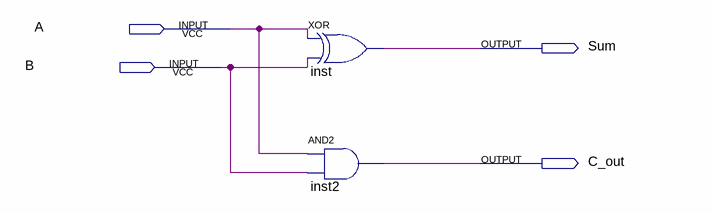
[diagram p0: schematic sheet]
// Quartus schematic HalfAdder.bdf as structural Verilog: 2 symbols, 4 pins
module HalfAdder (
  input  A,
  input  B,
  output Sum,
  output C_out
);

  xor inst (Sum, A, B);
  and inst2 (C_out, A, B);
endmodule
